# Altium schematic sheet Sheet2.SchDoc
size 152 x 88 mm
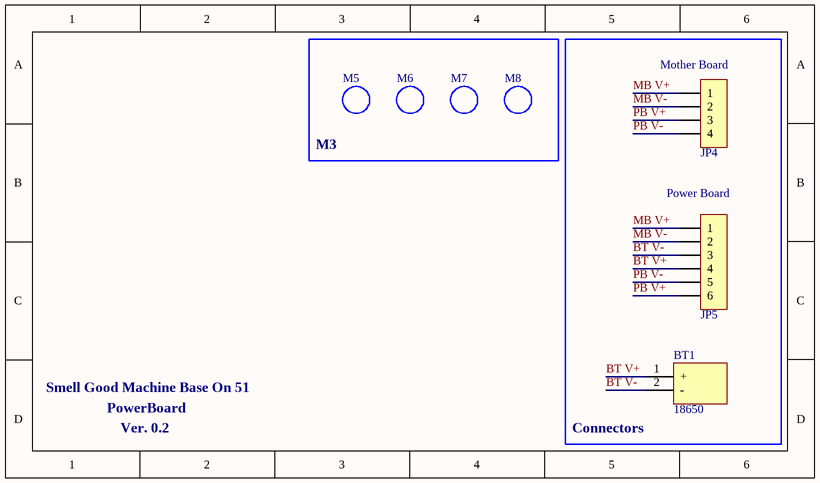
[diagram p0: Sheet2.SchDoc]

## Parts
BT1  18650  [18650_battery]
JP4  HDR-1X4  [HDR2.54-M-LI-4P]  (value not drawn)
JP5  HDR-1X6  [HDR2.54-M-LI-6P]  (value not drawn)
M5  M3  [M3x20_N]  (value not drawn)
M6  M3  [M3x20_N]  (value not drawn)
M7  M3  [M3x20_N]  (value not drawn)
M8  M3  [M3x20_N]  (value not drawn)

## Blocks framed on the sheet
M3: M5-M8
Connectors: BT1 JP4 JP5

## Nets
BT V+: BT1.1(+) JP5.4
BT V-: BT1.2(-) JP5.3
MB V+: JP4.1 JP5.1
MB V-: JP4.2 JP5.2
PB V+: JP4.3 JP5.6
PB V-: JP4.4 JP5.5

## Notes on the sheet
- (near JP4) Mother Board
- (near JP5) Power Board
- Smell Good Machine Base On 51
- PowerBoard
- Ver. 0.2

## Library data of the parts
BT1 = 18650: Battery; 淘宝ID: 小糖豆的小窝窝; BOM名称: 18650; 下单链接: https://item.taobao.com/item.htm?ft=t&id=613637044352
JP4 = Header 4: 4P接插件; 淘宝ID: 小糖豆的小窝窝; BOM名称: 4P接插件; 下单链接: https://item.taobao.com/item.htm?ft=t&id=613637044352
JP5 = Header 6: 6P接插件; 淘宝ID: 小糖豆的小窝窝; BOM名称: 6P接插件; 下单链接: https://item.taobao.com/item.htm?ft=t&id=613637044352
M5-M8 = M3: 铜柱孔; 淘宝ID: 小糖豆的小窝窝; BOM名称: 铜柱孔; 下单链接: https://item.taobao.com/item.htm?ft=t&id=613637044352